# EAGLE design ucurrent (EAGLE 7.6.0)
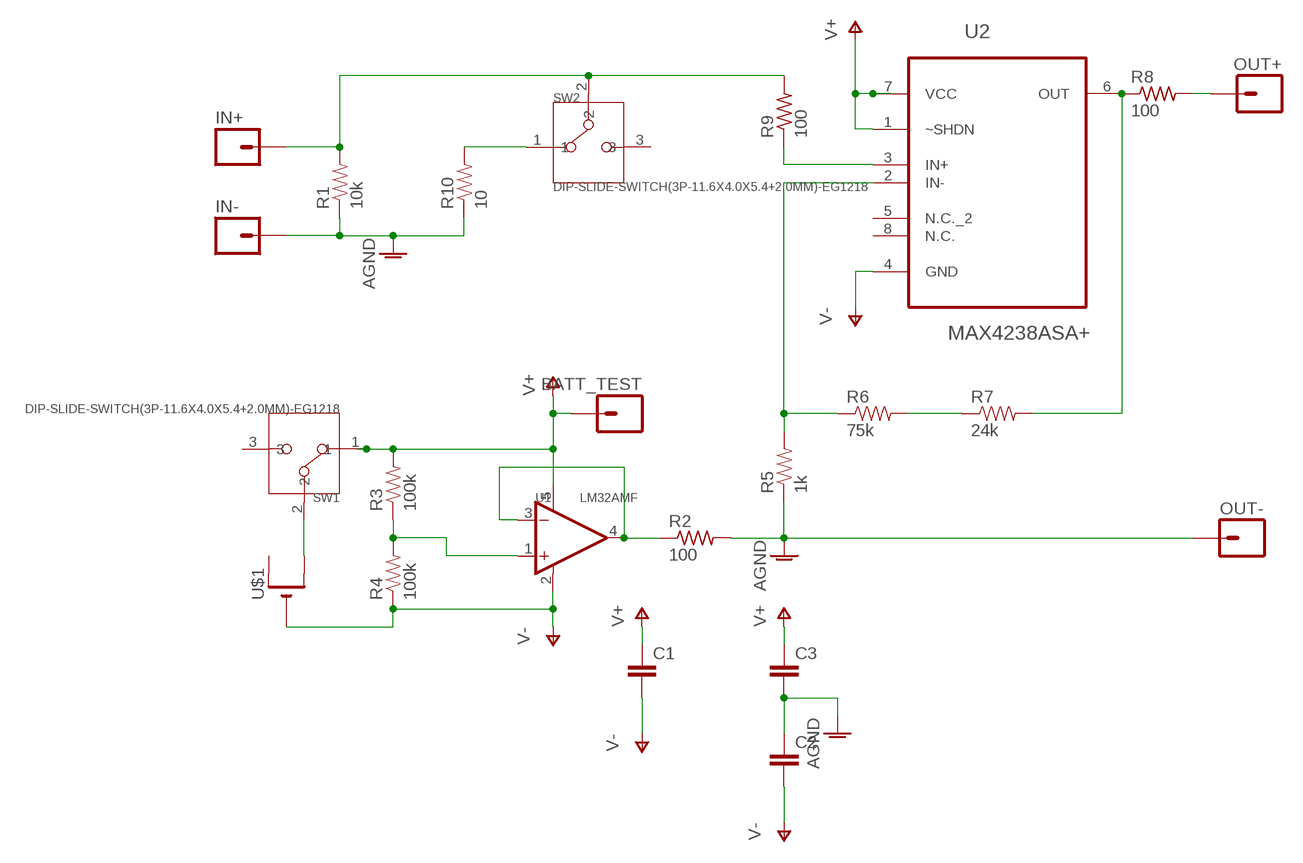
[diagram p0: schematic, sheet 1]

## Parts
BATT_TEST  M01PTH_LONGPAD  [1X01_LONGPAD]
C1  CAP0805  [0805]
C2  CAP0805  [0805]
C3  CAP0805  [0805]
IN+  M01PTH_LONGPAD  [1X01_LONGPAD]
IN-  M01PTH_LONGPAD  [1X01_LONGPAD]
OUT+  M01PTH_LONGPAD  [1X01_LONGPAD]
OUT-  M01PTH_LONGPAD  [1X01_LONGPAD]
R1  10k  RESISTOR0805-RES  [0805]
R2  100  R-US_0204/7  [0204/7]
R3  100k  RESISTOR0805-RES  [0805]
R4  100k  RESISTOR0805-RES  [0805]
R5  1k  RESISTOR0805-RES  [0805]
R6  75k  RESISTOR0805-RES  [0805]
R7  24k  RESISTOR0805-RES  [0805]
R8  100  R-US_0204/7  [0204/7]
R9  100  R-US_0204/7  [0204/7]
R10  10  RESISTOR0805-RES  [0805]
SW1  DIP-SLIDE-SWITCH(3P-11.6X4.0X5.4+2.0MM)-EG1218  [SW3-2.5-11.6X4.0X5.4+2.0MM]
SW2  DIP-SLIDE-SWITCH(3P-11.6X4.0X5.4+2.0MM)-EG1218  [SW3-2.5-11.6X4.0X5.4+2.0MM]
U1  LM32AMF  AMPLIFIER-LM321MF(SOT23-5)  [SOT-23-5]
U2  MAX4238ASA+  [SOIC127P600X175-8N]
U$1  CR2032SMT  [CR2032-SMD]

## Nets
AGND: C2.1 C3.2 IN-.1 OUT-.1 R1.1 R2.2 R5.1 R10.1
BAT+: SW1.2 U$1.+$2(+1)
IN+: IN+.1 R1.2 R9.2 SW2.2
N$1: R3.1 R4.2 U1.1(IN+)
N$2: R9.1 U2.3(IN+)
N$3: R7.2 R8.1 U2.6(OUT)
N$4: R6.2 R7.1
N$5: R5.2 R6.1 U2.2(IN-)
N$6: R2.1 U1.3(IN-) U1.4(OUT)
N$11: R10.2 SW2.1
OUT+: OUT+.1 R8.2
V+: BATT_TEST.1 C1.1 C3.1 R3.2 SW1.1 U1.5(V+) U2.1(~SHDN) U2.7(VCC)
V-: C1.2 C2.2 R4.1 U1.2(V-) U2.4(GND) U$1.-
Unconnected: SW1.3 SW2.3 U2.5(N.C._2) U2.8(N.C.) U$1.+$1(+)

## Library data of the parts
BATT_TEST IN+ IN- OUT+ OUT- = SparkFun-Connectors:M01: Header 1 Standard 1-pin 0.1" header. Use with straight break away headers (SKU : PRT-00116), right angle break away headers (PRT-00553), swiss pins (PRT-00743), machine pins (PRT-00117), and female headers (PRT-00115). SMTSO-256-ET is a "flush mount" nut for a 4-40 screw. The older package used to be too tight, and did not allow it to sit properly thru the drill hit. The latest (0.165DIA) fits nice and snug.
C1-C3 = SparkFun-Passives:CAP: Capacitor Standard 0603 ceramic capacitor, and 0.1" leaded capacitor.
R1 R3-R7 R10 = SparkFun-Passives:RESISTOR: Resistor Basic schematic elements and footprints for 0603, 1206, and PTH resistors.
R2 R8 R9 = rcl:R-US_: RESISTOR, American symbol
SW1 SW2 = Seeed-OPL-Switch:DIP-SLIDE-SWITCH(3P-11.6X4.0X5.4+2.0MM): 311010006
U1 = Seeed-OPL-ic:AMPLIFIER-LM321MF(SOT23-5): 310020001; MPN: LM321MF
U2 = Maxim_By_element14_Batch_1:MAX4238ASA+: Ultra-Low Offset/Drift, Low-Noise,Precision Amplifiers; MPN: MAX4238ASA+; OC_FARNELL: 1379966; OC_NEWARK: 53K6831; PACKAGE: SOIC-8; SUPPLIER: Maxim
U$1 = adafruit:CR2032

## Board
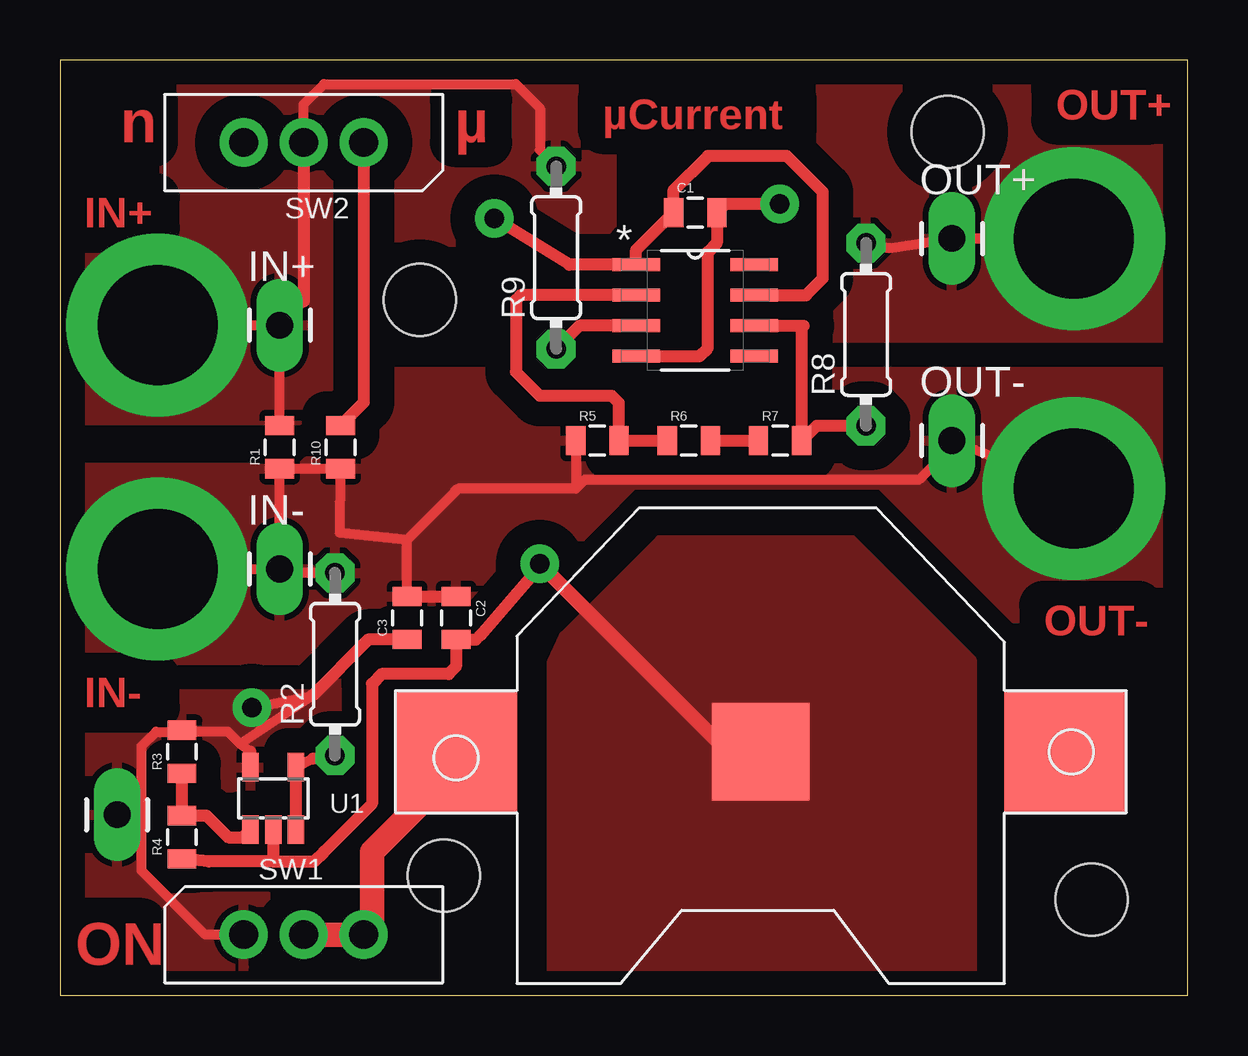
[diagram p1: board, top side]
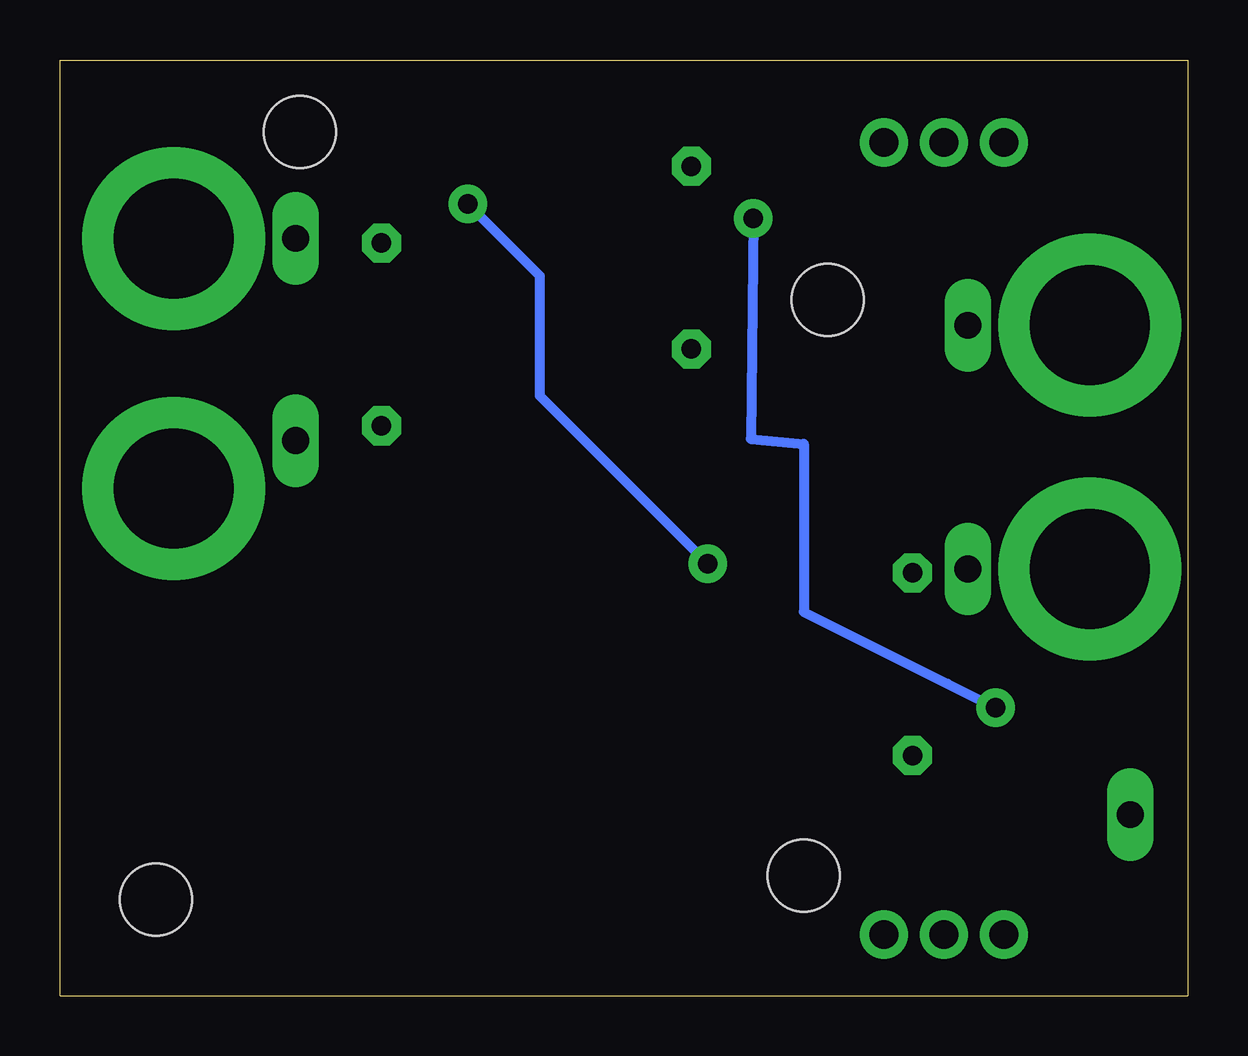
[diagram p2: board, bottom side, seen from below]

Size 47 x 39 mm. Coordinates in mm from the lower left corner, seen from the top.
Outline: 47,0 47,39 0,39 0,0 47,0
Copper layers (1*16): Top 0.035mm / dielectric 1.5mm / Bottom 0.035mm
Design rules "bens homebrew *": minimum track width 16mil, minimum drill 24mil, track to track 12mil, track to pad 12mil, pad to pad 12mil, via to via 12mil, smd to smd 8mil, copper to edge 40mil, drill to drill 8mil, minimum pad ring 16mil, minimum via ring 16mil, stop-mask expansion 4mil, vias tented up to drill 0mil, thermal gap 10mil
Holes 3 mm at 16,5 43,4 37,36 15,29

### Footprints (pad centres in the part's own frame; a part is rotated, then mirrored left to right if it is on the bottom)
1X01_LONGPAD = drill 1.118 pad 1.88 long: 1 0,0
0805 = smd 0.8 x 1.2: 1 -0.9,0; 2 0.9,0
0204/7 = drill 0.813 octagon: 1 -3.81,0; 2 3.81,0
SW3-2.5-11.6X4.0X5.4+2.0MM = drill 1.2: 1 -2.5,0; 2 0,0; 3 2.5,0
SOT-23-5 = smd 0.69 x 1.2: 1 -0.95,-1.3; 2 0,-1.3; 3 0.95,-1.3; 4 0.95,1.3; 5 -0.95,1.3
SOIC127P600X175-8N = smd 1.981 x 0.533: 1 -2.464,1.905; 2 -2.464,0.635; 3 -2.464,-0.635; 4 -2.464,-1.905; 5 2.464,-1.905; 6 2.464,-0.635; 7 2.464,0.635; 8 2.464,1.905
CR2032-SMD = smd 5.08 x 5.08: +$1 -12.7,0; +$2 12.7,0 | smd 4.064 x 4.064: - 0,0

### Placement (x,y rotation side)
BATT_TEST  2.38,7.54 0 top
C1  26.48,32.64 0 top
C2  16.51,15.74 270 top
C3  14.47,15.74 90 top
IN+  9.16,27.94 0 top
IN-  9.16,17.78 0 top
OUT+  37.18,31.56 0 top
OUT-  37.18,23.13 0 top
R1  9.16,22.86 90 top
R2  11.47,13.81 90 top
R3  5.08,10.16 90 top
R4  5.08,6.6 90 top
R5  22.4,23.13 0 top
R6  26.21,23.13 0 top
R7  30.02,23.13 0 top
R8  33.6,27.56 90 top
R9  20.68,30.76 90 top
R10  11.7,22.86 90 top
SW1  10.16,2.54 0 top
SW2  10.16,35.56 180 top
U1  8.89,8.22 0 top
U2  26.48,28.56 0 top
U$1  29.21,10.16 180 top

### Tracks (layer width: path | path; a pad name or v marks a point on that pad's centre or on a via)
AGND  (via drill 5 pad 7.62)
  Top 0.406: C3.2 14.47,19 | 14.47,19 11.67,19.29 R10.1 R1.1 IN-.1 9.32,17.62 R2.2 | 16.5,21.03 16.23,20.77 | 16.23,20.77 14.47,19 | 21.5,21.13 16.6,21.13 16.23,20.77 | R5.1 21.5,21.13 | OUT-.1 36.93,22.63 35.8,21.5 32.5,21.5 21.87,21.5 21.5,21.13 | v4.08,17.78 8.78,17.78 9,18 | v42.26,21.13 37.13,23.13 37,23
  Top 0.508: C3.2 C2.1
  pour Top (isolate 1.016, rank 2): 1,22 1,14 16.7,14 23.9,21.3 34.2,21.3 41.2,14.3 46,14 46,26 14,26 10,22
BAT+
  Top 1.016: SW1.2 12.54,2.54 13,3 13,5 13,6 16,9 16,9.65 U$1.+$2
IN+  (via drill 5 pad 7.62)
  Top 0.406: R1.2 IN+.1 | 10.16,28.94 IN+.1 | SW2.2 10.16,37.16 11,38 19,38 20,37 20,35.25 R9.2 | v4.08,27.94 IN+.1
  Top 0.508: SW2.2 10.16,28.94
  pour Top (isolate 1.016): 1,24 10,24 12,26 24,26 23,27 23,38 1,38
N$1
  Top 0.508: R3.1 R4.2 6.1,7.5 7,6.6 7.62,6.6 U1.1
N$2
  Top 0.508: U2.3 21.66,27.93 R9.1
N$3
  Top 0.406: 30.92,27.84 31,27.93
  Top 0.508: U2.6 31,27.93 | 30.92,27.84 R7.2 31.54,23.75 R8.1
N$4
  Top 0.508: R6.2 R7.1
N$5
  Top 0.508: R6.1 R5.2 23.3,24.7 23,25 20,25 19,26 19,29 19.2,29.2 U2.2
N$6
  Top 0.406: U1.4 10.54,9.88
  Top 0.508: 10.54,9.88 R2.1 | U1.3 U1.4
N$7  (via drill 2)
  other vias: 15,29
N$8  (via drill 2)
  other vias: 37,36
N$9  (via drill 2)
  other vias: 43,4
N$10  (via drill 2)
  other vias: 16,5
N$11
  Top 0.508: SW2.1 12.66,24.72 R10.2
OUT+  (via drill 5 pad 7.62)
  Top 0.406: R8.2 34.58,31.16 OUT+.1 v42.26,31.56
  pour Top (isolate 1.016, rank 3): 46,27 46,38 31,38 31,27
V+  (via drill 0.8)
  Top 0.406: 7.94,10.16 7.5,10.5 | 7.5,10.5 7,11 5.14,11 R3.2 5.02,11 4,11 3.4,10.4 3.4,5.2 6.06,2.54 SW1.1 | 7.5,10.5 10.5,12.5 v8,12
  Top 0.508: U1.5 7.94,10.16 | C3.1 12.84,14.84 10.5,12.5 | v18.1,32.4 21.23,30.46 U2.1 24.02,31.08 C1.1 25.58,33.58 27,35 30.3,35 31.8,33.5 31.8,29.9 31.09,29.2 U2.7
  Bottom 0.406: v18.1,32.4 18.2,23.2 16,23 16,16 10,13 v8,12
  pour Top (isolate 1.016, rank 3): 8,1 0,1 0,13 7,13 8,13 10,15 13,15 13,6
V-  (via drill 0.8)
  Top 0.406: 17.34,14.84 17.5,15 | U$1.- 27.84,10.16
  Top 0.508: 8.89,5.59 6.21,5.59 R4.1 | U2.4 26.66,26.66 27,27 27,31 27.38,31.38 C1.2 27.74,33 v30,33 | v20,18 20.1,18 17.5,15 | 17.34,14.84 C2.2 16.51,13.71 16.2,13.4 13.4,13.4 13,13 13,8 11,6 10.59,5.59 8.89,5.59 | U1.2 8.89,5.59
  Top 0.61: 27.84,10.16 v20,18
  Bottom 0.406: v20,18 27,25 27,30 v30,33
  pour Top (no thermals): 25,19 33,19 38,14 38,1 20.5,0.9 20.5,13.9 21,15

### Text on the board
Top: n | µ | µCurrent | OUT+ | IN+ | OUT- | IN- | ON